# Altium schematic sheet 02_PAB.SchDoc: =Proj_Title
size B; Address1: Haleiwa, HI 96712 USA; SheetNumber: 2
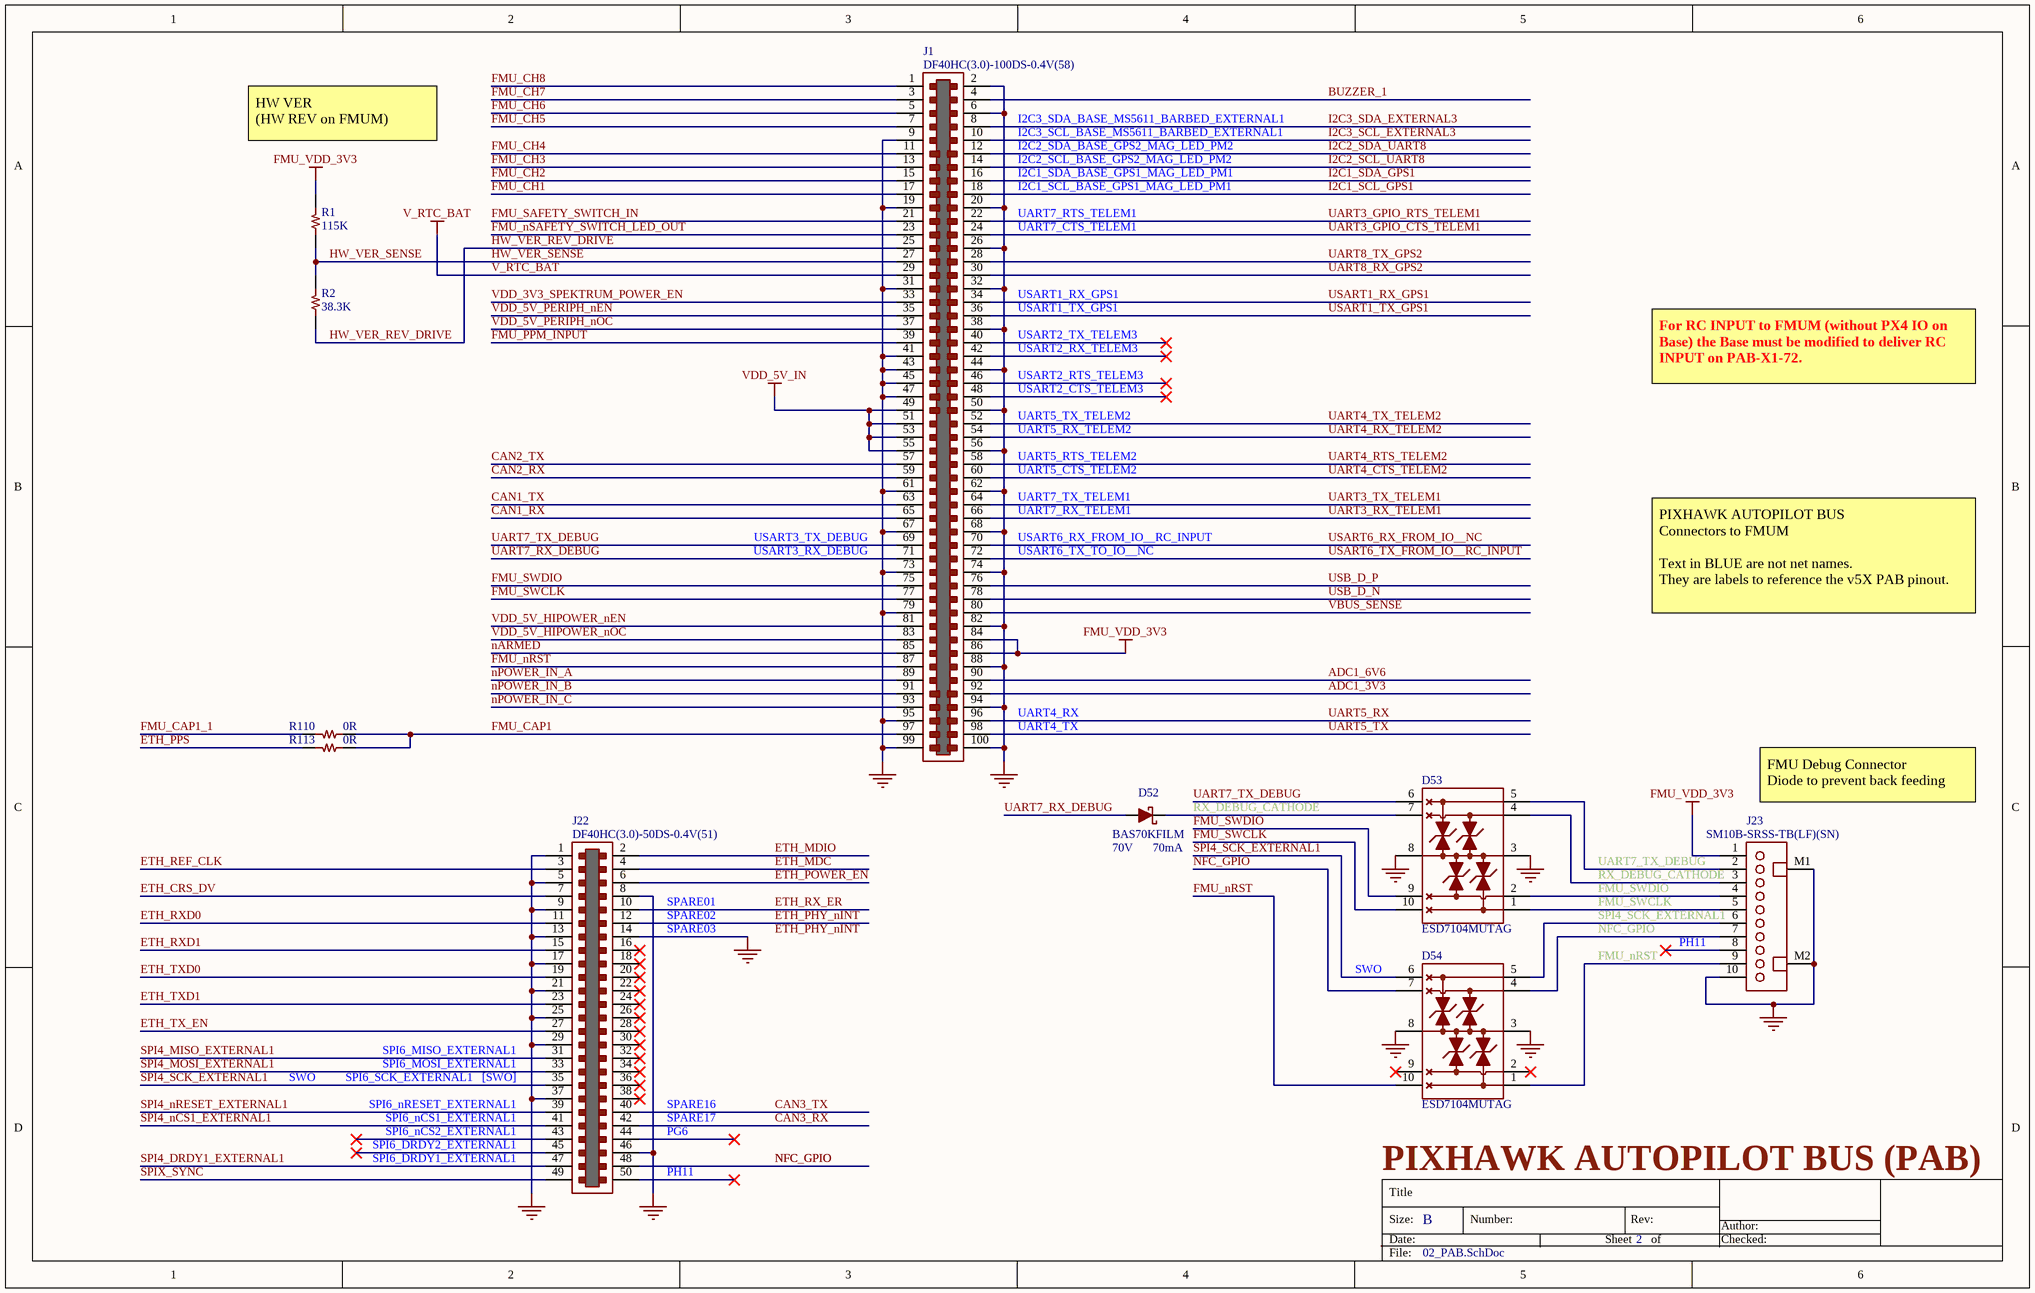
[diagram p0: 02_PAB.SchDoc]

## Parts
D52  Manufacturer Part Number: BAS70KFILM  Current: 70mA  Voltage: 70V  [SODFL120X80X70L30X30]  (hidden comment: DIODE SCHOTTKY 70V 70MA SOD523)
D53  Manufacturer Part Number: ESD7104MUTAG  [UDFN10P50_250X100X55L35X20N]  (hidden comment: DIODE TVS BIDIRECTIONAL 5V 10V 10UDFN)
D54  Manufacturer Part Number: ESD7104MUTAG  [UDFN10P50_250X100X55L35X20N]  (hidden comment: DIODE TVS BIDIRECTIONAL 5V 10V 10UDFN)
J1  Manufacturer Part Number: DF40HC(3.0)-100DS-0.4V(58)  [HIROSE_DF40HC3_0-100DS-0_4V51]  (hidden comment: CONN RCPT 100POS 0.4MM SMD GOLD)
J22  Manufacturer Part Number: DF40HC(3.0)-50DS-0.4V(51)  [HIROSE_DF40C-50DS-0-4V51]  (hidden comment: CONN RCPT 50POS 0.4MM SMD GOLD)
J23  Manufacturer Part Number: SM10B-SRSS-TB(LF)(SN)  [JST_SM10B-SRSS-TB]  (hidden comment: CONN HEADER SH 10POS SIDE 1MM SMT)
R1  value 115K  [RESC100X50X40L25]  (hidden comment: RES SMD 115K OHM 1% 1/16W 0402)
R2  value 38.3K  [RESC100X50X40L25]  (hidden comment: RES SMD 38.3K OHM 1% 1/16W 0402)
R110  value 0R  [RESC100X50X40L25]  (hidden comment: RES SMD 0 OHM 1% 1/16W 0402)
R113  value 0R  [RESC100X50X40L25]  (hidden comment: RES SMD 0 OHM 1% 1/16W 0402)

## Nets
FMU_VDD_3V3: J1.84 J1.86 J23.1 R1.1
GND: D53.3(GND) D53.8(GND) D54.3(GND) D54.8(GND) J1.2 J1.6 J1.9 J1.19 J1.20 J1.26 J1.31 J1.32 J1.38 J1.41 J1.43 J1.44 J1.45 J1.47 J1.50 J1.56 J1.61 J1.62 J1.67 J1.68 J1.73 J1.74 J1.79 J1.82 J1.88 J1.94 J1.95 J1.99 J1.100 J22.1 J22.5 J22.8 J22.9 J22.13 J22.14 J22.17 J22.21 J22.25 J22.29 J22.37 J22.46 J23.10 J23.M1 J23.M2
V_RTC_BAT: J1.29
VDD_5V_IN: J1.49 J1.51 J1.53 J1.55
ADC1_3V3: J1.92
ADC1_6V6: J1.90
BUZZER_1: J1.4
CAN1_RX: J1.65
CAN1_TX: J1.63
CAN2_RX: J1.59
CAN2_TX: J1.57
CAN3_RX: J22.42
CAN3_TX: J22.40
ETH_CRS_DV: J22.7
ETH_MDC: J22.4
ETH_MDIO: J22.2
ETH_PHY_nINT: J22.12
ETH_POWER_EN: J22.6
ETH_PPS: R113.1
ETH_REF_CLK: J22.3
ETH_RX_ER: J22.10
ETH_RXD0: J22.11
ETH_RXD1: J22.15
ETH_TX_EN: J22.27
ETH_TXD0: J22.19
ETH_TXD1: J22.23
FMU_CAP1: J1.97 R110.2 R113.2
FMU_CAP1_1: R110.1
FMU_CH1: J1.17
FMU_CH2: J1.15
FMU_CH3: J1.13
FMU_CH4: J1.11
FMU_CH5: J1.7
FMU_CH6: J1.5
FMU_CH7: J1.3
FMU_CH8: J1.1
FMU_nRST: D54.1 D54.10(NC) J1.87 J23.9
FMU_nSAFETY_SWITCH_LED_OUT: J1.23
FMU_PPM_INPUT: J1.39
FMU_SAFETY_SWITCH_IN: J1.21
FMU_SWCLK: D53.1 D53.10(NC) J1.77 J23.5
FMU_SWDIO: D53.2 D53.9(NC) J1.75 J23.4
HW_VER_REV_DRIVE: J1.25 R2.2
HW_VER_SENSE: J1.27 R1.2 R2.1
I2C1_SCL_GPS1: J1.18
I2C1_SDA_GPS1: J1.16
I2C2_SCL_UART8: J1.14
I2C2_SDA_UART8: J1.12
I2C3_SCL_EXTERNAL3: J1.10
I2C3_SDA_EXTERNAL3: J1.8
nARMED: J1.85
NFC_GPIO: D54.4 D54.7(NC) J22.48 J23.7
nPOWER_IN_A: J1.89
nPOWER_IN_B: J1.91
nPOWER_IN_C: J1.93
RX_DEBUG_CATHODE: D52.C D53.4 D53.7(NC) J23.3
SPI4_DRDY1_EXTERNAL1: J22.47
SPI4_MISO_EXTERNAL1: J22.31
SPI4_MOSI_EXTERNAL1: J22.33
SPI4_nCS1_EXTERNAL1: J22.41
SPI4_nRESET_EXTERNAL1: J22.39
SPI4_SCK_EXTERNAL1: D54.5 D54.6(NC) J22.35 J23.6
SPIX_SYNC: J22.49
UART3_GPIO_CTS_TELEM1: J1.24
UART3_GPIO_RTS_TELEM1: J1.22
UART3_RX_TELEM1: J1.66
UART3_TX_TELEM1: J1.64
UART4_CTS_TELEM2: J1.60
UART4_RTS_TELEM2: J1.58
UART4_RX_TELEM2: J1.54
UART4_TX_TELEM2: J1.52
UART5_RX: J1.96
UART5_TX: J1.98
UART7_RX_DEBUG: D52.A J1.71
UART7_TX_DEBUG: D53.5 D53.6(NC) J1.69 J23.2
UART8_RX_GPS2: J1.30
UART8_TX_GPS2: J1.28
USART1_RX_GPS1: J1.34
USART1_TX_GPS1: J1.36
USART6_RX_FROM_IO__NC: J1.70
USART6_TX_FROM_IO__RC_INPUT: J1.72
USB_D_N: J1.78
USB_D_P: J1.76
VBUS_SENSE: J1.80
VDD_3V3_SPEKTRUM_POWER_EN: J1.33
VDD_5V_HIPOWER_nEN: J1.81
VDD_5V_HIPOWER_nOC: J1.83
VDD_5V_PERIPH_nEN: J1.35
VDD_5V_PERIPH_nOC: J1.37

Not connected (* = marked no-connect by the designer): D54 2* 9(NC)*; J1 40* 42* 46* 48*; J22 16* 18* 20* 22* 24* 26* 28* 30* 32* 34* 36* 38* 43* 44* 45* 50*; J23 8*

## Notes on the sheet
- HW VER
  (HW REV on FMUM)
- I2C3_SDA_BASE_MS5611_BARBED_EXTERNAL1
- I2C3_SCL_BASE_MS5611_BARBED_EXTERNAL1
- I2C2_SDA_BASE_GPS2_MAG_LED_PM2
- I2C2_SCL_BASE_GPS2_MAG_LED_PM2
- UART7_RTS_TELEM1
- I2C1_SDA_BASE_GPS1_MAG_LED_PM1
- I2C1_SCL_BASE_GPS1_MAG_LED_PM1
- UART7_CTS_TELEM1
- USART1_RX_GPS1
- USART1_TX_GPS1
- USART2_TX_TELEM3
- USART2_RX_TELEM3
- USART2_RTS_TELEM3
- USART2_CTS_TELEM3
- UART5_TX_TELEM2
- UART5_RX_TELEM2
- For RC INPUT to FMUM (without PX4 IO on Base) the Base must be modified to deliver RC INPUT on PAB-X1-72.
- UART5_RTS_TELEM2
- UART5_CTS_TELEM2
- UART7_TX_TELEM1
- USART3_TX_DEBUG
- USART3_RX_DEBUG
- UART7_RX_TELEM1
- USART6_RX_FROM_IO__RC_INPUT
- USART6_TX_TO_IO__NC
- PIXHAWK AUTOPILOT BUS
  Connectors to FMUM
  Text in BLUE are not net names.
  They are labels to reference the v5X PAB pinout.
- UART4_RX
- UART4_TX
- FMU Debug Connector
  Diode to prevent back feeding
- SPARE01
- SPARE02
- SPARE03
- SWO
- (near J23) PH11
- SPI6_MISO_EXTERNAL1
- SPI6_MOSI_EXTERNAL1
- SPI6_SCK_EXTERNAL1   [SWO]
- SPI6_nRESET_EXTERNAL1
- SPARE16
- SPI6_nCS1_EXTERNAL1
- SPI6_nCS2_EXTERNAL1
- SPI6_DRDY2_EXTERNAL1
- SPI6_DRDY1_EXTERNAL1
- SPARE17
- PG6
- PH11
- PIXHAWK AUTOPILOT BUS (PAB)
- Labels drawn without touching a wire or pin: ETH_PHY_nINT
- Title
- Size:
- Date:
- B
- Number:
- Sheet
- Rev:
- of
- Author:
- Checked:
- File:

## Library data of the parts
D52 = DIODE_SCHOTTKY_BAS70_SOD523_SMT: Manufacturer: STMicroelectronics; Packaging: Cut Tape (CT); Part Status: Active; Supplier 1: Digi-Key; Supplier Part Number 1: 497-5695-1-ND; Category: Discrete Semiconductor Products; Stock 1: 20067; Pricing 1: 1=0.28, 10=0.23, 100=0.122, 500=0.08028, 1000=0.05459 (USD); ComponentLink1Description: https://www.digikey.com/product-detail/en/stmicroelectronics/BAS70KFILM/497-5695-1-ND/1299948; ComponentLink1URL: https://www.digikey.com/product-detail/en/stmicroelectronics/BAS70KFILM/497-5695-1-ND/1299948
D53 D54 = DIODE_TVS_4X_10UDFN: Manufacturer: ON Semiconductor; Packaging: Cut Tape (CT); Part Status: Active; Operating Temperature: -55°C ~ 125°C (TJ); Supplier 1: Digi-Key; Supplier Part Number 1: ESD7104MUTAGOSCT-ND; Category: Circuit Protection; Stock 1: 5750; Pricing 1: 1=0.63, 10=0.541, 100=0.40370, 500=0.31716, 1000=0.24508 (USD); ComponentLink1Description: https://www.digikey.com/product-detail/en/on-semiconductor/ESD7104MUTAG/ESD7104MUTAGOSCT-ND/3487538; ComponentLink1URL: https://www.digikey.com/product-detail/en/on-semiconductor/ESD7104MUTAG/ESD7104MUTAGOSCT-ND/3487538
J1 = CONN_RCPT_2X50_RECPT_0.4MM_SMD: Manufacturer: Hirose Electric Co Ltd; Number of Positions: 100; Pitch: 0.016" (0.40mm); System: Connector; Mated Stacking Heights: 3mm; Packaging: Cut Tape (CT); Part Status: Active; Number of Rows: 2; Mounting Type: Surface Mount; Operating Temperature: -65°C ~ 85°C; Supplier 1: Digi-Key; Supplier Part Number 1: H124602CT-ND; Category: Connectors, Interconnects; Stock 1: 2220; Pricing 1: 1=2.75 (USD); ComponentLink1Description: https://www.digikey.com/products/en/connectors-interconnects/rectangular-connectors-arrays-edge-type-mezzanine-board-to-board/308?k=df40hc%283.0%29-100&k=&pkeyword=df40hc%283.0%29-100&sv=0&pv7=2&sf=0&quantity=&ColumnSort=0&page=1&pageSize=25; ComponentLink1URL: https://www.digikey.com/products/en/connectors-interconnects/rectangular-connectors-arrays-edge-type-mezzanine-board-to-board/308?k=df40hc%283.0%29-100&k=&pkeyword=df40hc%283.0%29-100&sv=0&pv7=2&sf=0&quantity=&ColumnSort=0&page=1&pageSize=25
J22 = CONN_RCPT_2X25_RECPT_0.4MM_SMD: Manufacturer: Hirose Electric Co Ltd; Number of Positions: 50; Pitch: 0.016" (0.40mm); System: Connector; Mated Stacking Heights: 3mm; Packaging: Cut Tape (CT); Part Status: Active; Number of Rows: 2; Mounting Type: Surface Mount; Operating Temperature: -65°C ~ 85°C; Supplier 1: Digi-Key; Supplier Part Number 1: H11915CT-ND; Category: Connectors, Interconnects; Stock 1: 8712; Pricing 1: 1=1.05, 10=0.926, 25=0.8712, 50=0.835, 100=0.7986, 250=0.726, 500=0.6534, 1000=0.5808 (USD); ComponentLink1Description: https://www.digikey.com/products/en/connectors-interconnects/rectangular-connectors-arrays-edge-type-mezzanine-board-to-board/308?k=DF40HC%283.0%29-50DS-0.4V%2851%29&k=&pkeyword=DF40HC%283.0%29-50DS-0.4V%2851%29&sv=0&pv7=2&sf=0&quantity=&ColumnSort=0&page=1&pageSize=25; ComponentLink1URL: https://www.digikey.com/products/en/connectors-interconnects/rectangular-connectors-arrays-edge-type-mezzanine-board-to-board/308?k=DF40HC%283.0%29-50DS-0.4V%2851%29&k=&pkeyword=DF40HC%283.0%29-50DS-0.4V%2851%29&sv=0&pv7=2&sf=0&quantity=&ColumnSort=0&page=1&pageSize=25
J23 = CONN_JST_SH_10PIN_RA_SMT: Manufacturer: JST Sales America Inc.; Voltage - Rated: 50V; System: Connector; Packaging: Cut Tape (CT); Part Status: Active; Operating Temperature: -25°C ~ 85°C; Supplier 1: Digi-Key; Supplier Part Number 1: 455-1810-1-ND; Category: Connectors, Interconnects; Stock 1: 62595; Pricing 1: 1=1.06, 10=9.32, 100=0.8037, 500=0.65758, 1000=0.58452 (USD); ComponentLink1Description: https://www.digikey.com/products/en/connectors-interconnects/rectangular-connectors-headers-male-pins/314?k=SM10B-SRSS&k=&pkeyword=SM10B-SRSS&pv1989=0&sf=0&FV=ffe0013a%2C1c0002&quantity=&ColumnSort=0&page=1&pageSize=25; ComponentLink1URL: https://www.digikey.com/products/en/connectors-interconnects/rectangular-connectors-headers-male-pins/314?k=SM10B-SRSS&k=&pkeyword=SM10B-SRSS&pv1989=0&sf=0&FV=ffe0013a%2C1c0002&quantity=&ColumnSort=0&page=1&pageSize=25
R1 = RES_115K_1%_1/16W_0402: Manufacturer: Vishay Dale; Manufacturer Part Number: CRCW0402115KFKED; Packaging: Cut Tape (CT); Part Status: Active; Tolerance: ±1%; Operating Temperature: -55°C ~ 155°C; Supplier 1: Digi-Key; Supplier Part Number 1: 541-115KLCT-ND; Category: Resistors; Stock 1: 32374; Pricing 1: 1=0.1, 10=0.014, 100=0.0056, 1000=0.00253, 2500=0.0022, 5000=0.00181 (USD); Power: 1/16W; ComponentLink1Description: https://www.digikey.com/products/en/resistors/chip-resistor-surface-mount/52?k=&pkeyword=&sv=0&v=541&pv2085=u115+kOhms&sf=0&FV=2%7C7854%2C3%7C1131%2C7%7C2%2C1989%7C0%2C-8%7C52%2C174%7C411742&quantity=&ColumnSort=0&page=1&pageSize=25; ComponentLink1URL: https://www.digikey.com/products/en/resistors/chip-resistor-surface-mount/52?k=&pkeyword=&sv=0&v=541&pv2085=u115+kOhms&sf=0&FV=2%7C7854%2C3%7C1131%2C7%7C2%2C1989%7C0%2C-8%7C52%2C174%7C411742&quantity=&ColumnSort=0&page=1&pageSize=25
R2 = RES_38.3K_1%_1/16W_0402: Manufacturer: Yageo; Manufacturer Part Number: RC0402FR-0738K3L; Packaging: Cut Tape (CT); Part Status: Active; Tolerance: ±1%; Operating Temperature: -55°C ~ 155°C; Supplier 1: Digi-Key; Supplier Part Number 1: YAG3141CT-ND; Category: Resistors; Stock 1: 92389; Pricing 1: 1=0.1, 10=0.014, 100=0.0056, 1000=0.00253, 2500=0.0022, 5000=0.00181 (USD); Power: 1/16W; ComponentLink1Description: https://www.digikey.com/products/en/resistors/chip-resistor-surface-mount/52?k=RC0402FR-0738K3L&k=&pkeyword=RC0402FR-0738K3L&sv=0&pv7=2&sf=0&quantity=&ColumnSort=0&page=1&pageSize=25; ComponentLink1URL: https://www.digikey.com/products/en/resistors/chip-resistor-surface-mount/52?k=RC0402FR-0738K3L&k=&pkeyword=RC0402FR-0738K3L&sv=0&pv7=2&sf=0&quantity=&ColumnSort=0&page=1&pageSize=25
R110 R113 = RES_0R_1%_1/16W_0402: Manufacturer: Yageo; Manufacturer Part Number: RC0402JR-070RL; Packaging: Cut Tape (CT); Part Status: Active; Tolerance: ±1%; Operating Temperature: -55°C ~ 155°C; Supplier 1: Digi-Key; Supplier Part Number 1: 311-0.0JRCT-ND; Category: Resistors; Stock 1: 34962204; Pricing 1: 1=0.1, 10=0.014, 100=0.0056, 1000=0.00253, 2500=0.0022, 5000=0.00181 (USD); Power: 1/16W; ComponentLink1Description: https://www.digikey.com/product-detail/en/yageo/RC0402JR-070RL/311-0.0JRCT-ND/729353; ComponentLink1URL: https://www.digikey.com/product-detail/en/yageo/RC0402JR-070RL/311-0.0JRCT-ND/729353